# EAGLE design protoboard_demo (EAGLE 5.11)
PROJECT: Protoboard v1 (.650 xQFP)
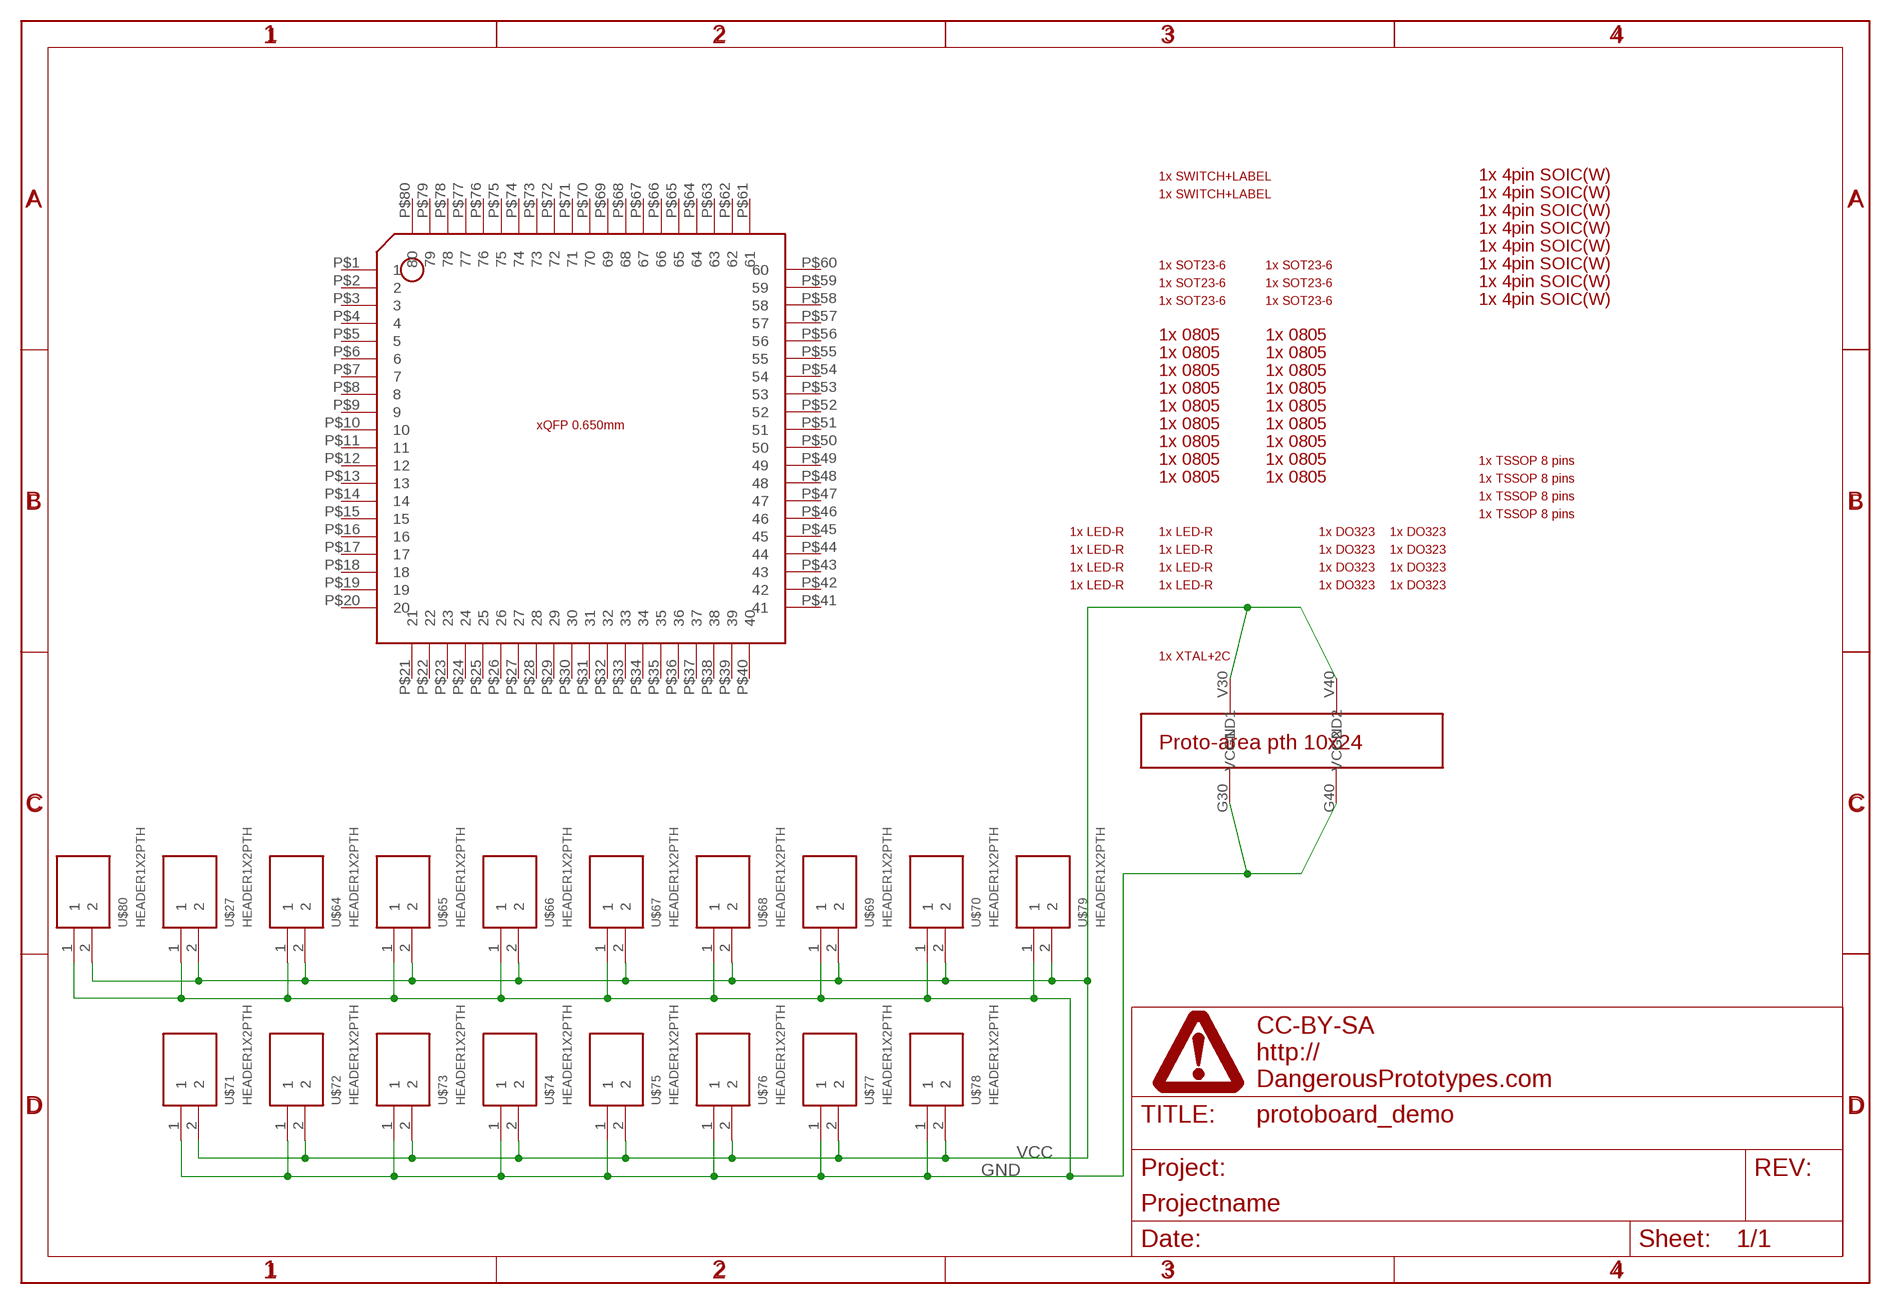
[diagram p0: schematic, sheet 1]

## Parts
U$1  DINA4_L  [DP_LOGO]
U$2  BB_SOICW  [BB_SOIC]
U$3  BB_SOICW  [BB_SOIC]
U$4  BB_SOICW  [BB_SOIC]
U$5  BB_SOICW  [BB_SOIC]
U$6  BB_SOICW  [BB_SOIC]
U$7  BB_SOICW  [BB_SOIC]
U$8  BB_SOICW  [BB_SOIC]
U$9  BB_SOICW  [BB_SOIC]
U$10  BB_TSSOP_065  [BB_TSSOP_0650]
U$11  BB_TSSOP_065  [BB_TSSOP_0650]
U$12  BB_TSSOP_065  [BB_TSSOP_0650]
U$13  BB_TSSOP_065  [BB_TSSOP_0650]
U$14  BB_SW  [BB_SW]
U$15  BB_SW  [BB_SW]
U$16  BB_SOT23-6  [BB_SOT23-6]
U$17  BB_SOT23-6  [BB_SOT23-6]
U$18  BB_SOT23-6  [BB_SOT23-6]
U$19  BB_SOT23-6  [BB_SOT23-6]
U$20  PROTO_10X24  [PROTO_10_24]
U$21  BB_RC0805  [BB_RC0805]
U$22  BB_RC0805  [BB_RC0805]
U$23  BB_RC0805  [BB_RC0805]
U$24  BB_RC0805  [BB_RC0805]
U$25  BB_RC0805  [BB_RC0805]
U$26  BB_RC0805  [BB_RC0805]
U$27  HEADER1X2PTH  [M1X2]
U$28  BB_LED  [BB_LED]
U$29  BB_LED  [BB_LED]
U$30  BB_LED  [BB_LED]
U$31  BB_LED  [BB_LED]
U$32  BB_DO323  [BB_DO323]
U$33  BB_DO323  [BB_DO323]
U$34  BB_DO323  [BB_DO323]
U$35  BB_DO323  [BB_DO323]
U$36  BB_DO323  [BB_DO323]
U$37  BB_DO323  [BB_DO323]
U$38  BB_DO323  [BB_DO323]
U$39  BB_DO323  [BB_DO323]
U$40  BB_XTAL  [BB_XTAL]
U$41  BB_RC0805  [BB_RC0805]
U$43  BB_SOT23-6  [BB_SOT23-6]
U$44  BB_SOT23-6  [BB_SOT23-6]
U$45  BB_LED  [BB_LED]
U$46  BB_LED  [BB_LED]
U$47  BB_LED  [BB_LED]
U$48  BB_LED  [BB_LED]
U$53  BB_RC0805  [BB_RC0805]
U$54  BB_RC0805  [BB_RC0805]
U$55  BB_RC0805  [BB_RC0805]
U$56  BB_RC0805  [BB_RC0805]
U$57  BB_RC0805  [BB_RC0805]
U$58  BB_RC0805  [BB_RC0805]
U$59  BB_RC0805  [BB_RC0805]
U$60  BB_RC0805  [BB_RC0805]
U$61  BB_RC0805  [BB_RC0805]
U$62  BB_RC0805  [BB_RC0805]
U$63  BB_RC0805  [BB_RC0805]
U$64  HEADER1X2PTH  [M1X2]
U$65  HEADER1X2PTH  [M1X2]
U$66  HEADER1X2PTH  [M1X2]
U$67  HEADER1X2PTH  [M1X2]
U$68  HEADER1X2PTH  [M1X2]
U$69  HEADER1X2PTH  [M1X2]
U$70  HEADER1X2PTH  [M1X2]
U$71  HEADER1X2PTH  [M1X2]
U$72  HEADER1X2PTH  [M1X2]
U$73  HEADER1X2PTH  [M1X2]
U$74  HEADER1X2PTH  [M1X2]
U$75  HEADER1X2PTH  [M1X2]
U$76  HEADER1X2PTH  [M1X2]
U$77  HEADER1X2PTH  [M1X2]
U$78  HEADER1X2PTH  [M1X2]
U$79  HEADER1X2PTH  [M1X2]
U$80  HEADER1X2PTH  [M1X2]
U$82  BB_XQFP_065BB  [BB_QFP_065_BREAKOUT_BOARD]

## Nets
GND: U$20.G30(GND1) U$20.G40(GND2) U$27.1 U$64.1 U$65.1 U$66.1 U$67.1 U$68.1 U$69.1 U$70.1 U$71.1 U$72.1 U$73.1 U$74.1 U$75.1 U$76.1 U$77.1 U$78.1 U$79.1 U$80.1
VCC: U$20.V30(VCC1) U$20.V40(VCC2) U$27.2 U$64.2 U$65.2 U$66.2 U$67.2 U$68.2 U$69.2 U$70.2 U$71.2 U$72.2 U$73.2 U$74.2 U$75.2 U$76.2 U$77.2 U$78.2 U$79.2 U$80.2
Unconnected: U$82.P$1 U$82.P$2 U$82.P$3 U$82.P$4 U$82.P$5 U$82.P$6 U$82.P$7 U$82.P$8 U$82.P$9 U$82.P$10 U$82.P$11 U$82.P$12 U$82.P$13 U$82.P$14 U$82.P$15 U$82.P$16 U$82.P$17 U$82.P$18 U$82.P$19 U$82.P$20 U$82.P$21 U$82.P$22 U$82.P$23 U$82.P$24 U$82.P$25 U$82.P$26 U$82.P$27 U$82.P$28 U$82.P$29 U$82.P$30 U$82.P$31 U$82.P$32 U$82.P$33 U$82.P$34 U$82.P$35 U$82.P$36 U$82.P$37 U$82.P$38 U$82.P$39 U$82.P$40 U$82.P$41 U$82.P$42 U$82.P$43 U$82.P$44 U$82.P$45 U$82.P$46 U$82.P$47 U$82.P$48 U$82.P$49 U$82.P$50 U$82.P$51 U$82.P$52 U$82.P$53 U$82.P$54 U$82.P$55 U$82.P$56 U$82.P$57 U$82.P$58 U$82.P$59 U$82.P$60 U$82.P$61 U$82.P$62 U$82.P$63 U$82.P$64 U$82.P$65 U$82.P$66 U$82.P$67 U$82.P$68 U$82.P$69 U$82.P$70 U$82.P$71 U$82.P$72 U$82.P$73 U$82.P$74 U$82.P$75 U$82.P$76 U$82.P$77 U$82.P$78 U$82.P$79 U$82.P$80

## Library data of the parts
U$1 = dp_devices:DINA4_L: A4 DP frame Standard Dangerous Prototypes schematic frame. Automagically adds the DP logo and standard texts to the PCB Use the atrribute in the schematic editor to change the fields.; FF1: fulfillment by; FF2: Seeed Studio; FF3: www.seeedstudio.com; LICENSE: CC-BY-SA; PROJECT: Projectname; URL1: http://; URL2: DangerousPrototypes.com
U$2-U$9 = DP_protoboard:BB_SOICW
U$10-U$13 = DP_protoboard:BB_TSSOP_065: Use grid 0.650mm to place!
U$14 U$15 = DP_protoboard:BB_SW
U$16-U$19 U$43 U$44 = DP_protoboard:BB_SOT23-6
U$20 = DP_protoboard:PROTO_10X24
U$21-U$26 U$41 U$53-U$63 = DP_protoboard:BB_RC0805
U$27 U$64-U$80 = dp_devices:HEADER1X2
U$28-U$31 U$45-U$48 = DP_protoboard:BB_LED
U$32-U$39 = DP_protoboard:BB_DO323
U$40 = DP_protoboard:BB_XTAL
U$82 = DP_protoboard:BB_XQFP_065

## Board
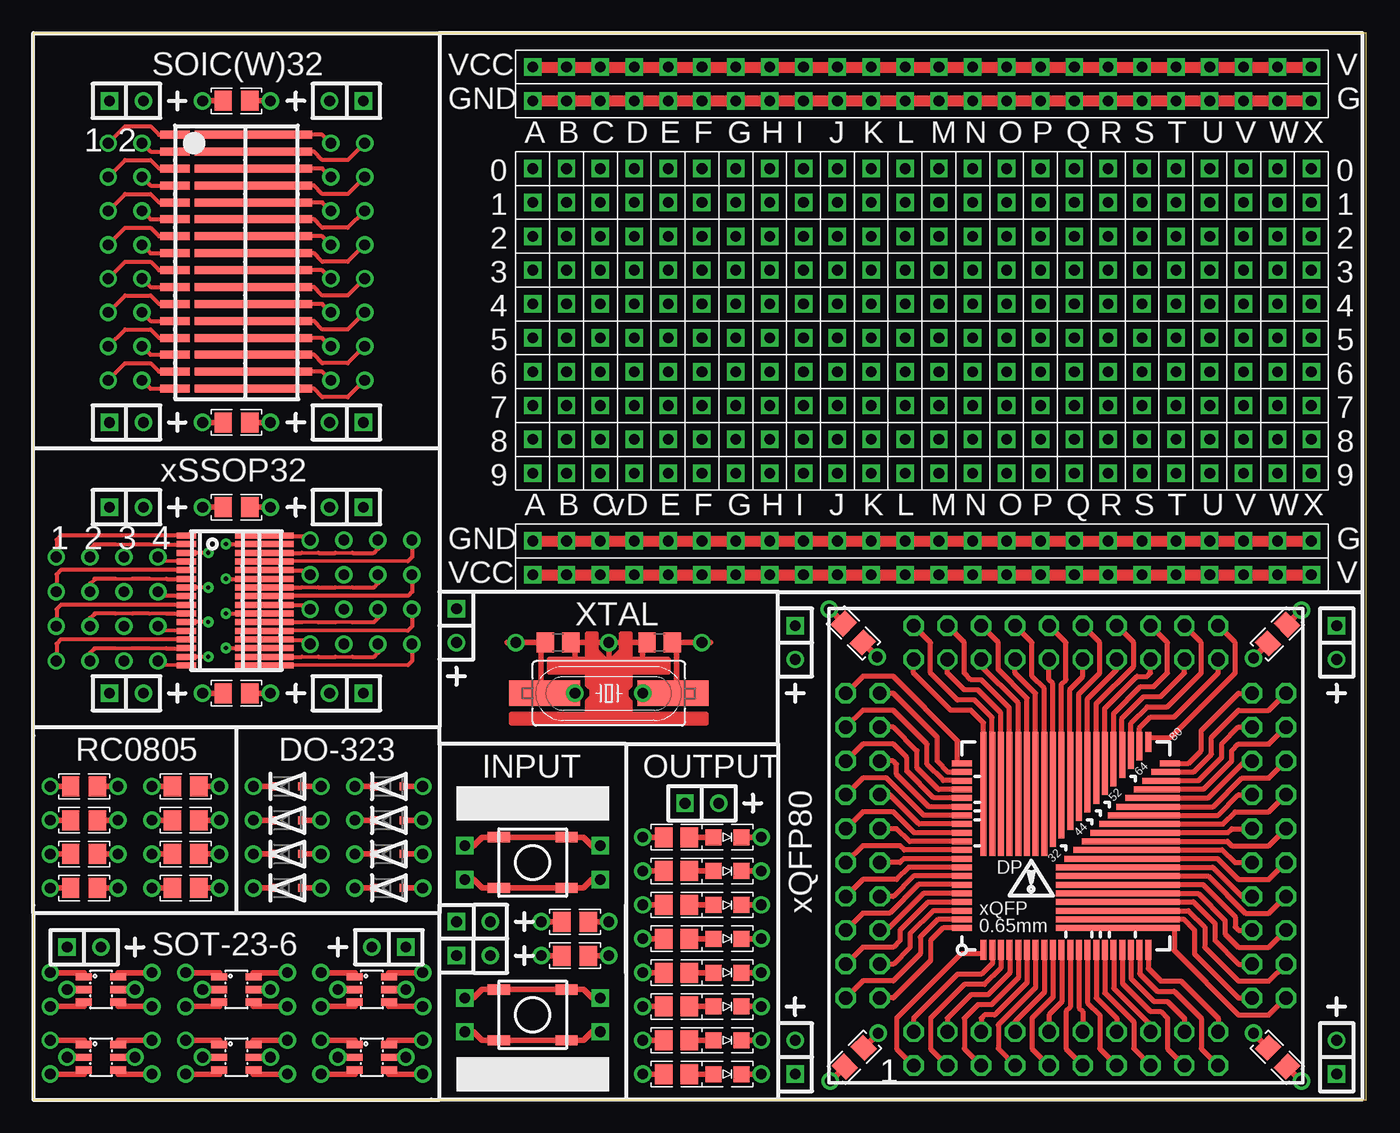
[diagram p1: board, top side]
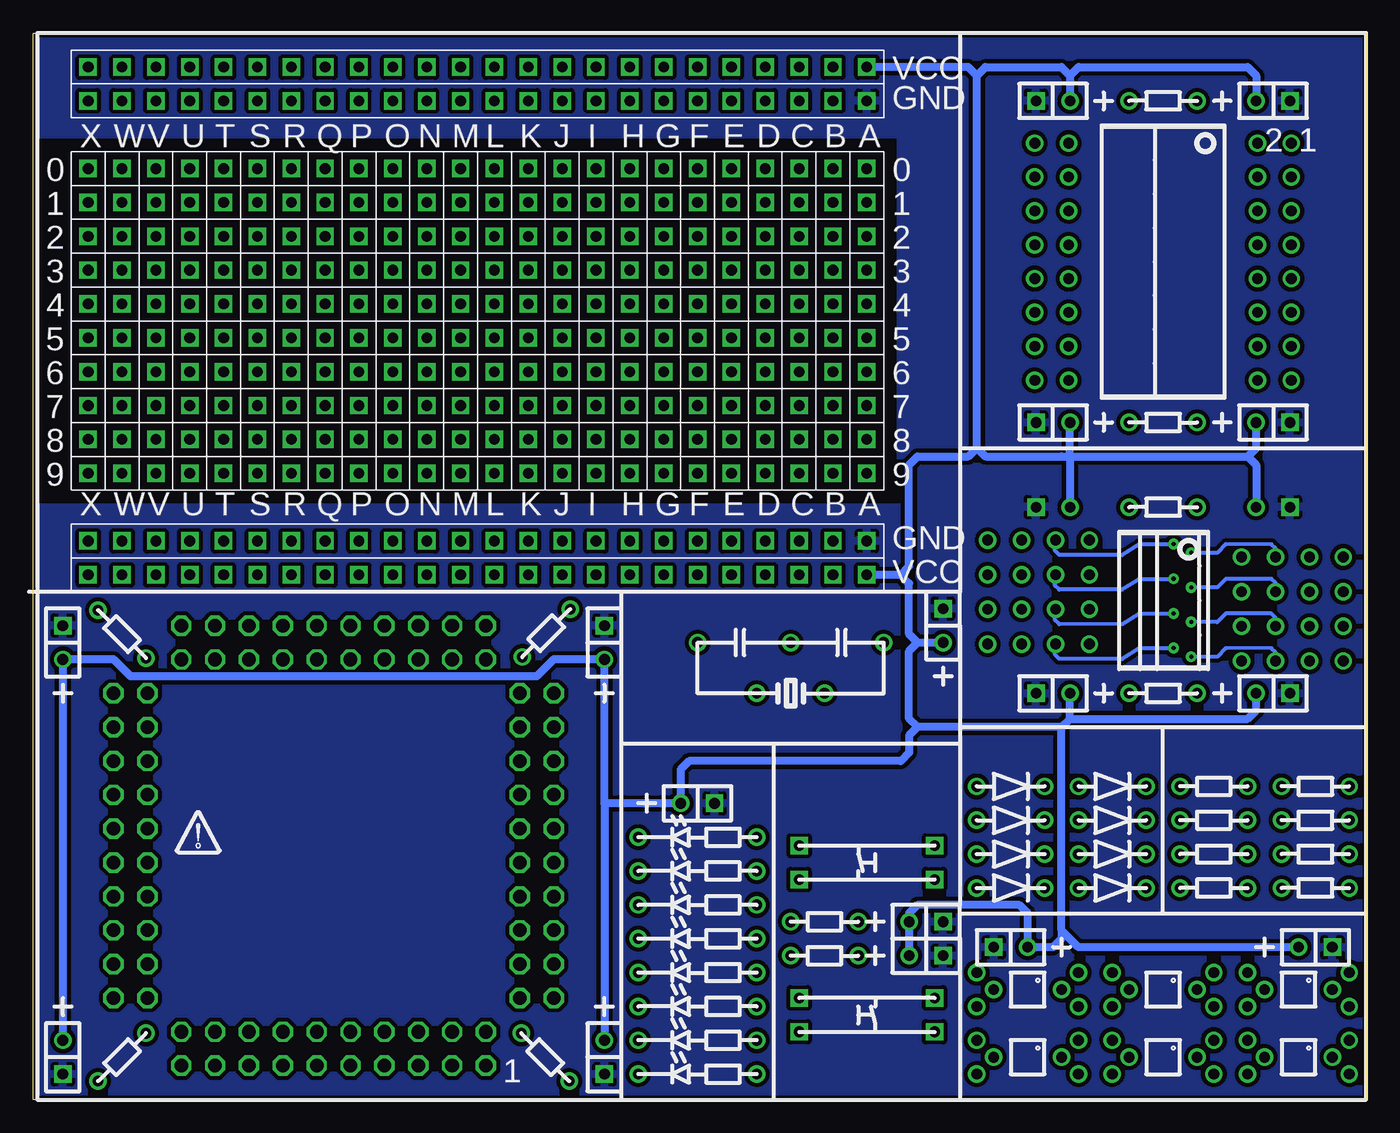
[diagram p2: board, bottom side, seen from below]

Size 100 x 80 mm. Coordinates in mm from the lower left corner, seen from the top.
Outline: 0,0 100,0 100,80 0,80 0,0
Copper layers (1*16): Top 0.035mm / dielectric 1.5mm / Bottom 0.035mm
Design rules "Fusion_eagle_rule_v1.1": minimum track width 6mil, minimum drill 12mil, track to track 6mil, track to pad 6mil, pad to pad 6mil, via to via 6mil, smd to smd 0mil, copper to edge 10mil, drill to drill 10mil, minimum pad ring 10mil, minimum via ring 6mil, stop-mask expansion 2mil, vias tented up to drill 100mil, thermal gap 10mil

### Footprints (pad centres in the part's own frame; a part is rotated, then mirrored left to right if it is on the bottom)
BB_SOIC = smd 2.2 x 0.6: P$1 -4.61,0.635; P$2 -4.61,-0.635 | smd 8.8 x 0.6: P$3 1.27,-0.635; P$4 1.27,0.635 | drill 0.8 round: P$5 -7.08,0; P$6 -9.62,0; P$7 7.08,0; P$8 9.62,0
BB_TSSOP_0650 = smd 1.45 x 0.45: P$1 -2.925,0; P$2 -2.925,-0.65; P$7 -2.925,0.65; P$8 -2.925,1.3 | smd 4.4 x 0.45: P$3 2.925,1.3; P$4 2.925,-0.65; P$5 2.925,0; P$6 2.925,0.65 | drill 0.8 round: P$18 -5.08,-0.318; P$21 -7.62,-0.318; P$22 -10.16,-0.318; P$23 -12.7,-0.318; P$24 6.35,0.953; P$28 8.89,0.953; P$29 11.43,0.953; P$30 13.97,0.953 | drill 0.305 round: P$25 -1.285,0; P$26 0.03,0.65
BB_SW = smd 1.651 x 0.762: 1 -2.54,1.905; 2 2.54,1.905; 3 -2.54,-1.905; 4 2.54,-1.905 | drill 0.8 square: P$1 -5.08,1.27; P$2 -5.08,-1.27; P$3 5.08,1.27; P$4 5.08,-1.27
BB_SOT23-6 = smd 0.55 x 1.2: 1 -0.95,-1.3; 2 0,-1.3; 3 0.95,-1.3; 4 0.95,1.3; 5 0,1.3; 6 -0.95,1.3 | drill 0.8 round: P$1 1.27,-3.81; P$2 0,-2.54; P$3 -1.27,-3.81; P$4 0,2.54; P$5 1.27,3.81; P$6 -1.27,3.81
PROTO_10_24 = drill 0.8 square: 1 -29.21,-11.43; 2 -26.67,-11.43; 3 -24.13,-11.43; 4 -21.59,-11.43; 5 -19.05,-11.43; 6 -16.51,-11.43; 7 -13.97,-11.43; 8 -11.43,-11.43; 9 -8.89,-11.43; 10 -6.35,-11.43; 11 -3.81,-11.43; 12 -1.27,-11.43; 13 1.27,-11.43; 14 3.81,-11.43; 15 6.35,-11.43; 16 8.89,-11.43; 17 11.43,-11.43; 18 13.97,-11.43; 19 16.51,-11.43; 20 19.05,-11.43; 21 21.59,-11.43; 22 24.13,-11.43; 23 26.67,-11.43; 24 29.21,-11.43; 25 -29.21,-8.89; 26 -26.67,-8.89; 27 -24.13,-8.89; 28 -21.59,-8.89; 29 -19.05,-8.89; 30 -16.51,-8.89; 31 -13.97,-8.89; 32 -11.43,-8.89; 33 -8.89,-8.89; 34 -6.35,-8.89; 35 -3.81,-8.89; 36 -1.27,-8.89; 37 1.27,-8.89; 38 3.81,-8.89; 39 6.35,-8.89; 40 8.89,-8.89; 41 11.43,-8.89; 42 13.97,-8.89; 43 16.51,-8.89; 44 19.05,-8.89; 45 21.59,-8.89; 46 24.13,-8.89; 47 26.67,-8.89; 48 29.21,-8.89; 49 -29.21,-6.35; 50 -26.67,-6.35; 51 -24.13,-6.35; 52 -21.59,-6.35; 53 -19.05,-6.35; 54 -16.51,-6.35; 55 -13.97,-6.35; 56 -11.43,-6.35; 57 -8.89,-6.35; 58 -6.35,-6.35; 59 -3.81,-6.35; 60 -1.27,-6.35; 61 1.27,-6.35; 62 3.81,-6.35; 63 6.35,-6.35; 64 8.89,-6.35; 65 11.43,-6.35; 66 13.97,-6.35; 67 16.51,-6.35; 68 19.05,-6.35; 69 21.59,-6.35; 70 24.13,-6.35; 71 26.67,-6.35; 72 29.21,-6.35; 73 -29.21,-3.81; 74 -26.67,-3.81; 75 -24.13,-3.81; 76 -21.59,-3.81; 77 -19.05,-3.81; 78 -16.51,-3.81; 79 -13.97,-3.81; 80 -11.43,-3.81; 81 -8.89,-3.81; 82 -6.35,-3.81; 83 -3.81,-3.81; 84 -1.27,-3.81; 85 1.27,-3.81; 86 3.81,-3.81; 87 6.35,-3.81; 88 8.89,-3.81; 89 11.43,-3.81; 90 13.97,-3.81; 91 16.51,-3.81; 92 19.05,-3.81; 93 21.59,-3.81; 94 24.13,-3.81; 95 26.67,-3.81; 96 29.21,-3.81; 97 -29.21,-1.27; 98 -26.67,-1.27; 99 -24.13,-1.27; 100 -21.59,-1.27; 101 -19.05,-1.27; 102 -16.51,-1.27; 103 -13.97,-1.27; 104 -11.43,-1.27; 105 -8.89,-1.27; 106 -6.35,-1.27; 107 -3.81,-1.27; 108 -1.27,-1.27; 109 1.27,-1.27; 110 3.81,-1.27; 111 6.35,-1.27; 112 8.89,-1.27; 113 11.43,-1.27; 114 13.97,-1.27; 115 16.51,-1.27; 116 19.05,-1.27; 117 21.59,-1.27; 118 24.13,-1.27; 119 26.67,-1.27; 120 29.21,-1.27; 121 -29.21,1.27; 122 -26.67,1.27; 123 -24.13,1.27; 124 -21.59,1.27; 125 -19.05,1.27; 126 -16.51,1.27; 127 -13.97,1.27; 128 -11.43,1.27; 129 -8.89,1.27; 130 -6.35,1.27; 131 -3.81,1.27; 132 -1.27,1.27; 133 1.27,1.27; 134 3.81,1.27; 135 6.35,1.27; 136 8.89,1.27; 137 11.43,1.27; 138 13.97,1.27; 139 16.51,1.27; 140 19.05,1.27; 141 21.59,1.27; 142 24.13,1.27; 143 26.67,1.27; 144 29.21,1.27; 145 -29.21,3.81; 146 -26.67,3.81; 147 -24.13,3.81; 148 -21.59,3.81; 149 -19.05,3.81; 150 -16.51,3.81; 151 -13.97,3.81; 152 -11.43,3.81; 153 -8.89,3.81; 154 -6.35,3.81; 155 -3.81,3.81; 156 -1.27,3.81; 157 1.27,3.81; 158 3.81,3.81; 159 6.35,3.81; 160 8.89,3.81; 161 11.43,3.81; 162 13.97,3.81; 163 16.51,3.81; 164 19.05,3.81; 165 21.59,3.81; 166 24.13,3.81; 167 26.67,3.81; 168 29.21,3.81; 169 -29.21,6.35; 170 -26.67,6.35; 171 -24.13,6.35; 172 -21.59,6.35; 173 -19.05,6.35; 174 -16.51,6.35; 175 -13.97,6.35; 176 -11.43,6.35; 177 -8.89,6.35; 178 -6.35,6.35; 179 -3.81,6.35; 180 -1.27,6.35; 181 1.27,6.35; 182 3.81,6.35; 183 6.35,6.35; 184 8.89,6.35; 185 11.43,6.35; 186 13.97,6.35; 187 16.51,6.35; 188 19.05,6.35; 189 21.59,6.35; 190 24.13,6.35; 191 26.67,6.35; 192 29.21,6.35; 193 -29.21,8.89; 194 -26.67,8.89; 195 -24.13,8.89; 196 -21.59,8.89; 197 -19.05,8.89; 198 -16.51,8.89; 199 -13.97,8.89; 200 -11.43,8.89; 201 -8.89,8.89; 202 -6.35,8.89; 203 -3.81,8.89; 204 -1.27,8.89; 205 1.27,8.89; 206 3.81,8.89; 207 6.35,8.89; 208 8.89,8.89; 209 11.43,8.89; 210 13.97,8.89; 211 16.51,8.89; 212 19.05,8.89; 213 21.59,8.89; 214 24.13,8.89; 215 26.67,8.89; 216 29.21,8.89; 217 -29.21,11.43; 218 -26.67,11.43; 219 -24.13,11.43; 220 -21.59,11.43; 221 -19.05,11.43; 222 -16.51,11.43; 223 -13.97,11.43; 224 -11.43,11.43; 225 -8.89,11.43; 226 -6.35,11.43; 227 -3.81,11.43; 228 -1.27,11.43; 229 1.27,11.43; 230 3.81,11.43; 231 6.35,11.43; 232 8.89,11.43; 233 11.43,11.43; 234 13.97,11.43; 235 16.51,11.43; 236 19.05,11.43; 237 21.59,11.43; 238 24.13,11.43; 239 26.67,11.43; 240 29.21,11.43; G30 -29.21,16.51; G31 -26.67,16.51; G32 -24.13,16.51; G33 -21.59,16.51; G34 -19.05,16.51; G35 -16.51,16.51; G36 -13.97,16.51; G37 -11.43,16.51; G38 -8.89,16.51; G39 -6.35,16.51; G40 -29.21,-16.51; G41 -26.67,-16.51; G42 -24.13,-16.51; G43 -21.59,-16.51; G44 -19.05,-16.51; G45 -16.51,-16.51; G46 -13.97,-16.51; G47 -11.43,-16.51; G48 -8.89,-16.51; G49 -6.35,-16.51; G310 -3.81,16.51; G311 -1.27,16.51; G312 1.27,16.51; G313 3.81,16.51; G314 6.35,16.51; G315 8.89,16.51; G316 11.43,16.51; G317 13.97,16.51; G318 16.51,16.51; G319 19.05,16.51; G320 21.59,16.51; G321 24.13,16.51; G322 26.67,16.51; G323 29.21,16.51; G410 -3.81,-16.51; G411 -1.27,-16.51; G412 1.27,-16.51; G413 3.81,-16.51; G414 6.35,-16.51; G415 8.89,-16.51; G416 11.43,-16.51; G417 13.97,-16.51; G418 16.51,-16.51; G419 19.05,-16.51; G420 21.59,-16.51; G421 24.13,-16.51; G422 26.67,-16.51; G423 29.21,-16.51; V30 -29.21,19.05; V31 -26.67,19.05; V32 -24.13,19.05; V33 -21.59,19.05; V34 -19.05,19.05; V35 -16.51,19.05; V36 -13.97,19.05; V37 -11.43,19.05; V38 -8.89,19.05; V39 -6.35,19.05; V40 -29.21,-19.05; V41 -26.67,-19.05; V42 -24.13,-19.05; V43 -21.59,-19.05; V44 -19.05,-19.05; V45 -16.51,-19.05; V46 -13.97,-19.05; V47 -11.43,-19.05; V48 -8.89,-19.05; V49 -6.35,-19.05; V310 -3.81,19.05; V311 -1.27,19.05; V312 1.27,19.05; V313 3.81,19.05; V314 6.35,19.05; V315 8.89,19.05; V316 11.43,19.05; V317 13.97,19.05; V318 16.51,19.05; V319 19.05,19.05; V320 21.59,19.05; V321 24.13,19.05; V322 26.67,19.05; V323 29.21,19.05; V410 -3.81,-19.05; V411 -1.27,-19.05; V412 1.27,-19.05; V413 3.81,-19.05; V414 6.35,-19.05; V415 8.89,-19.05; V416 11.43,-19.05; V417 13.97,-19.05; V418 16.51,-19.05; V419 19.05,-19.05; V420 21.59,-19.05; V421 24.13,-19.05; V422 26.67,-19.05; V423 29.21,-19.05
BB_RC0805 = smd 1.3 x 1.5: P$1 -1,0; P$2 1,0 | drill 0.8 round: P$3 -2.54,0; P$4 2.54,0
M1X2 = drill 0.8 square: 1 -1.27,0 | drill 0.8 round: 2 1.27,0
BB_LED = smd 1.3 x 1.5: 1 -4.76,0; 2 -2.86,0 | smd 1.2 x 1.2: A -1.05,0; C 1.05,0 | drill 0.8 round: P$1 2.54,0; P$2 -6.35,0
BB_DO323 = smd 0.6 x 0.6: A 1.1,0; C -1.1,0 | drill 0.8 round: P$1 -2.54,0; P$2 2.54,0
BB_XTAL = smd 5.334 x 1.93: 1 -4.826,-2.54; 2 4.826,-2.54 | smd 1.3 x 1.5: 3 -4.76,1.27; 4 -2.86,1.27; 5 2.86,1.27; 6 4.76,1.27 | drill 0.8 round: P$1 -6.985,1.27; P$2 6.985,1.27; P$3 0,1.27; P$4 -2.54,-2.54; P$5 2.54,-2.54
BB_QFP_065_BREAKOUT_BOARD = smd 0.45 x 1.5: 1 -6.175,-7.8; 2 -5.525,-7.8; 3 -4.875,-7.8; 4 -4.225,-7.8; 5 -3.575,-7.8; 6 -2.925,-7.8; 7 -2.275,-7.8; 8 -1.625,-7.8; 9 -0.975,-7.8; 10 -0.325,-7.8; 11 0.325,-7.8; 12 0.975,-7.8; 13 1.625,-7.8; 14 2.275,-7.8; 15 2.925,-7.8; 16 3.575,-7.8; 17 4.225,-7.8; 18 4.875,-7.8; 19 5.525,-7.8; 20 6.175,-7.8; 41 6.2,7.8 | smd 9.3 x 0.45: 21 3.9,-6.175; 22 3.9,-5.525; 23 3.9,-4.875; 24 3.9,-4.225; 25 3.9,-3.575; 26 3.9,-2.925; 27 3.9,-2.275; 28 3.9,-1.625 | smd 8.65 x 0.45: 29 4.225,-0.975 | smd 8 x 0.45: 30 4.55,-0.325 | smd 7.35 x 0.45: 31 4.875,0.325 | smd 6.7 x 0.45: 32 5.2,0.975 | smd 6.05 x 0.45: 33 5.525,1.625 | smd 5.4 x 0.45: 34 5.85,2.275 | smd 4.75 x 0.45: 35 6.175,2.925 | smd 4.1 x 0.45: 36 6.5,3.575 | smd 3.45 x 0.45: 37 6.825,4.225 | smd 2.8 x 0.45: 38 7.15,4.875 | smd 2.15 x 0.45: 39 7.475,5.525 | smd 1.5 x 0.45: 40 7.8,6.175; 61 -7.8,6.175; 62 -7.8,5.525; 63 -7.8,4.875; 64 -7.8,4.225; 65 -7.8,3.575; 66 -7.8,2.925; 67 -7.8,2.275; 68 -7.8,1.625; 69 -7.8,0.975; 70 -7.8,0.325; 71 -7.8,-0.325; 72 -7.8,-0.975; 73 -7.8,-1.625; 74 -7.8,-2.275; 75 -7.8,-2.925; 76 -7.8,-3.575; 77 -7.8,-4.225; 78 -7.8,-4.875; 79 -7.8,-5.525; 80 -7.8,-6.175 | smd 0.45 x 2.15: 42 5.525,7.475 | smd 0.45 x 2.8: 43 4.875,7.15 | smd 0.45 x 3.45: 44 4.225,6.825 | smd 0.45 x 4.1: 45 3.575,6.5 | smd 0.45 x 4.75: 46 2.925,6.175 | smd 0.45 x 5.4: 47 2.275,5.85 | smd 0.45 x 6.05: 48 1.625,5.525 | smd 0.45 x 6.7: 49 0.975,5.2 | smd 0.45 x 7.35: 50 0.325,4.875 | smd 0.45 x 8: 51 -0.325,4.55 | smd 0.45 x 8.65: 52 -0.975,4.225 | smd 0.45 x 9.3: 53 -1.625,3.9; 54 -2.275,3.9; 55 -2.925,3.9; 56 -3.575,3.9; 57 -4.225,3.9; 58 -4.875,3.9; 59 -5.525,3.9; 60 -6.175,3.9 | drill 1.016 octagon: P$1 -11.43,-16.51; P$2 -11.43,-13.97; P$3 -8.89,-16.51; P$4 -8.89,-13.97; P$5 -6.35,-16.51; P$6 -6.35,-13.97; P$7 -3.81,-16.51; P$8 -3.81,-13.97; P$9 -1.27,-16.51; P$10 -1.27,-13.97; P$11 1.27,-16.51; P$12 1.27,-13.97; P$13 3.81,-16.51; P$14 3.81,-13.97; P$15 6.35,-16.51; P$16 6.35,-13.97; P$17 8.89,-16.51; P$18 8.89,-13.97; P$19 11.43,-16.51; P$20 11.43,-13.97; P$21 16.51,-11.43; P$22 13.97,-11.43; P$23 16.51,-8.89; P$24 13.97,-8.89; P$25 16.51,-6.35; P$26 13.97,-6.35; P$27 16.51,-3.81; P$28 13.97,-3.81; P$29 16.51,-1.27; P$30 13.97,-1.27; P$31 16.51,1.27; P$32 13.97,1.27; P$33 16.51,3.81; P$34 13.97,3.81; P$35 16.51,6.35; P$36 13.97,6.35; P$37 16.51,8.89; P$38 13.97,8.89; P$39 16.51,11.43; P$40 13.97,11.43; P$41 11.43,16.51; P$42 11.43,13.97; P$43 8.89,16.51; P$44 8.89,13.97; P$45 6.35,16.51; P$46 6.35,13.97; P$47 3.81,16.51; P$48 3.81,13.97; P$49 1.27,16.51; P$50 1.27,13.97; P$51 -1.27,16.51; P$52 -1.27,13.97; P$53 -3.81,16.51; P$54 -3.81,13.97; P$55 -6.35,16.51; P$56 -6.35,13.97; P$57 -8.89,16.51; P$58 -8.89,13.97; P$59 -11.43,16.51; P$60 -11.43,13.97; P$61 -16.51,11.43; P$62 -13.97,11.43; P$63 -16.51,8.89; P$64 -13.97,8.89; P$65 -16.51,6.35; P$66 -13.97,6.35; P$67 -16.51,3.81; P$68 -13.97,3.81; P$69 -16.51,1.27; P$70 -13.97,1.27; P$71 -16.51,-1.27; P$72 -13.97,-1.27; P$73 -16.51,-3.81; P$74 -13.97,-3.81; P$75 -16.51,-6.35; P$76 -13.97,-6.35; P$77 -16.51,-8.89; P$78 -13.97,-8.89; P$79 -16.51,-11.43; P$80 -13.97,-11.43

### Placement (x,y rotation side)
U$1  87.63,19.05 0 bottom
U$2  15.24,59.05 0 top
U$3  15.24,64.14 0 top
U$4  15.24,61.59 0 top
U$5  15.24,66.67 0 top
U$6  15.24,56.52 0 top
U$7  15.24,69.22 0 top
U$8  15.24,53.98 0 top
U$9  15.24,71.75 0 top
U$10  14.42,33.23 0 top
U$11  14.42,35.83 0 top
U$12  14.42,38.42 0 top
U$13  14.42,41.02 0 top
U$14  37.47,17.78 180 top
U$15  37.47,6.35 0 top
U$16  5.08,8.26 270 top
U$17  15.24,8.26 270 top
U$18  25.4,8.26 270 top
U$19  5.08,3.17 270 top
U$20  66.67,58.42 0 top
U$21  61.59,3.17 45 top
U$22  40.64,13.34 180 top
U$23  93.34,34.92 45 top
U$24  61.52,35 135 top
U$25  93.34,3.17 135 top
U$26  40.64,10.79 0 top
U$27  3.81,11.43 0 top
U$28  52.07,19.68 0 top
U$29  52.07,17.14 0 top
U$30  52.07,12.06 0 top
U$31  52.07,14.61 0 top
U$32  19.05,20.95 0 top
U$33  19.05,18.41 0 top
U$34  19.05,15.88 0 top
U$35  26.67,23.5 0 top
U$36  26.67,20.95 0 top
U$37  26.67,18.41 0 top
U$38  26.67,15.88 0 top
U$39  19.05,23.5 0 top
U$40  43.18,33.02 0 top
U$41  11.43,15.88 0 top
U$43  15.24,3.17 270 top
U$44  25.4,3.17 270 top
U$45  52.07,9.53 0 top
U$46  52.07,6.99 0 top
U$47  52.07,4.45 0 top
U$48  52.07,1.91 0 top
U$53  3.81,20.95 0 top
U$54  3.81,15.88 0 top
U$55  3.81,18.41 0 top
U$56  15.24,50.8 0 top
U$57  15.24,74.93 0 top
U$58  11.43,18.41 0 top
U$59  15.24,30.48 0 top
U$60  15.24,44.45 0 top
U$61  11.43,20.95 0 top
U$62  11.43,23.5 0 top
U$63  3.81,23.5 0 top
U$64  97.79,34.29 270 top
U$65  97.79,3.17 90 top
U$66  57.15,3.17 90 top
U$67  57.15,34.29 270 top
U$68  33.02,13.34 0 top
U$69  33.02,10.79 0 top
U$70  26.67,11.43 180 top
U$71  6.99,30.48 0 top
U$72  23.5,30.48 180 top
U$73  23.5,44.45 180 top
U$74  6.99,44.45 0 top
U$75  6.99,50.8 0 top
U$76  23.5,50.8 180 top
U$77  6.99,74.93 0 top
U$78  23.5,74.93 180 top
U$79  50.16,22.23 0 top
U$80  31.75,35.56 270 top
U$82  77.47,19.05 0 top

### Tracks (layer width: path | path; a pad name or v marks a point on that pad's centre or on a via)
GND
  pour Bottom (isolate 0.305): 0,0 99.69,0 99.69,44.45 34.92,44.45 34.92,72.39 99.69,72.39 99.69,80.01 0,80.01
VCC
  Bottom 0.61: 22.23,28.57 U$72.2 | U$71.2 8.26,29.21 8.89,28.57 22.23,28.57 | 22.23,48.26 U$73.2 | U$77.2 8.26,76.83 8.89,77.47 21.59,77.47 22.23,76.83 | 22.23,76.83 U$78.2 | 22.23,76.83 22.86,77.47 28.57,77.47 29.21,76.83 | 29.21,48.9 29.21,76.83 | 29.21,48.9 28.57,48.26 22.86,48.26 | 22.86,48.26 22.23,48.26 | 22.23,48.26 U$76.2 | 33.66,34.29 34.29,34.92 34.29,38.73 34.92,39.37 | 29.21,48.9 29.84,48.26 33.66,48.26 34.29,47.62 34.29,40.01 34.92,39.37 | 33.66,34.29 U$80.2 | 33.66,34.29 34.29,33.66 34.29,28.57 33.66,27.94 | 22.86,27.94 33.66,27.94 | 22.86,27.94 22.23,28.57 | 57.15,22.23 U$66.2 | 57.15,22.23 U$67.2 60.96,33.02 62.23,31.75 92.71,31.75 93.98,33.02 U$64.2 U$65.2 | 57.15,22.23 U$79.2 51.44,24.77 50.8,25.4 34.92,25.4 34.29,26.04 34.29,27.3 33.66,27.94 | U$68.2 U$69.2 U$68.2 | U$68.2 34.29,13.97 33.66,14.61 26.04,14.61 25.4,13.97 U$70.2 23.5,11.43 22.86,12.06 22.86,12.7 | U$20.V30 29.84,77.47 29.21,76.83 | 34.92,39.37 U$20.V40 | U$75.2 8.26,48.9 8.89,48.26 | 22.86,48.26 8.89,48.26 | U$74.2 8.26,47.62 8.89,48.26 | 22.86,12.7 22.86,27.94 | U$27.2 21.59,11.43 22.86,12.7

### Text on the board
tPlace: SOIC(W)32 | 1 | 2 | xSSOP32 | v | 1 | 2 | 3 | 4 | XTAL | RC0805 | DO-323 | INPUT | OUTPUT | xQFP80 | SOT-23-6 | 1
bPlace: 1 | 2 | 1